# EAGLE design BK-GBC (EAGLE 9.1.0)
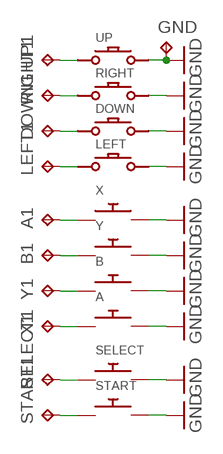
[diagram p0: schematic, sheet 1]

## Parts
A  SWITCH_PUSH_VMUHOLE  [KEYPAD-VMU-HOLE]
A1  TPPAD1-17  [P1-17]
B  SWITCH_PUSH_VMUHOLE  [KEYPAD-VMU-HOLE]
B1  TPPAD1-17  [P1-17]
DOWN  DMG-BTNDPAD  [DS-LITE-DPAD]
DOWN1  TPPAD1-17  [P1-17]
GND  TPPAD1-17  [P1-17]
LEFT  DMG-BTNDPAD  [DS-LITE-DPAD]
LEFT1  TPPAD1-17  [P1-17]
RIGHT  DMG-BTNDPAD  [DS-LITE-DPAD]
RIGHT1  TPPAD1-17  [P1-17]
SELECT  SWITCH_PUSH_VMUSMALL-PAD  [SMALL_KEYPAD]
SELECT1  TPPAD1-17  [P1-17]
START  SWITCH_PUSH_VMUSMALL-PAD  [SMALL_KEYPAD]
START1  TPPAD1-17  [P1-17]
UP  DMG-BTNDPAD  [DS-LITE-DPAD]
UP1  TPPAD1-17  [P1-17]
X  SWITCH_PUSH_VMULARGE-PAD  [KEYPAD_VMU_R26]
X1  TPPAD1-17  [P1-17]
Y  SWITCH_PUSH_VMULARGE-PAD  [KEYPAD_VMU_R26]
Y1  TPPAD1-17  [P1-17]

## Nets
GND: A.2 B.2 DOWN.P$4 GND.TP LEFT.P$4 RIGHT.P$4 SELECT.2 START.2 UP.P$4 X.2 Y.2
N$1: UP1.TP UP.P$3
N$2: RIGHT1.TP RIGHT.P$3
N$3: DOWN1.TP DOWN.P$3
N$4: LEFT1.TP LEFT.P$3
N$5: A1.TP X.1
N$6: B1.TP Y.1
N$7: B.1 Y1.TP
N$8: A.1 X1.TP
N$9: SELECT1.TP SELECT.1
N$10: START1.TP START.1

## Library data of the parts
A B SELECT START X Y = vmuzero:SWITCH_PUSH_VMU: Buttons SWITCH_PUSH_VMU - Soft touch temporary push button for VMU
A1 B1 DOWN1 GND LEFT1 RIGHT1 SELECT1 START1 UP1 X1 Y1 = testpad:TP: Test pad
DOWN LEFT RIGHT UP = Game Boy:DMG-BTN

## Board
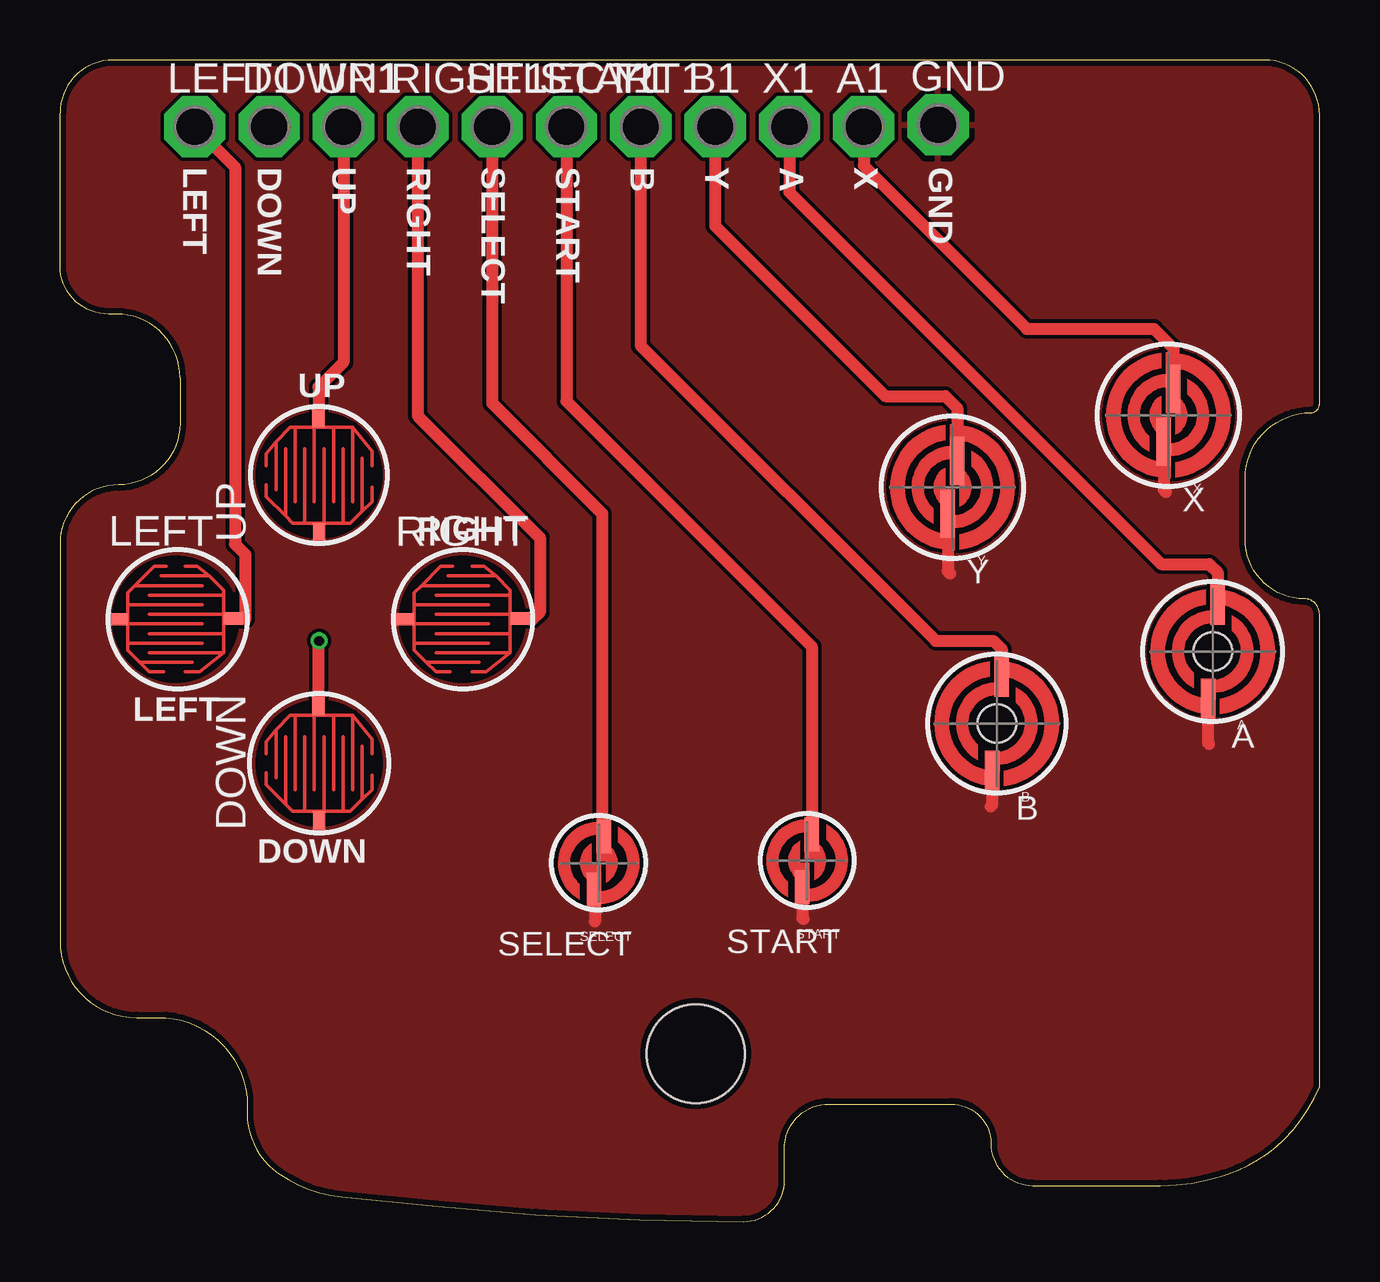
[diagram p1: board, top side]
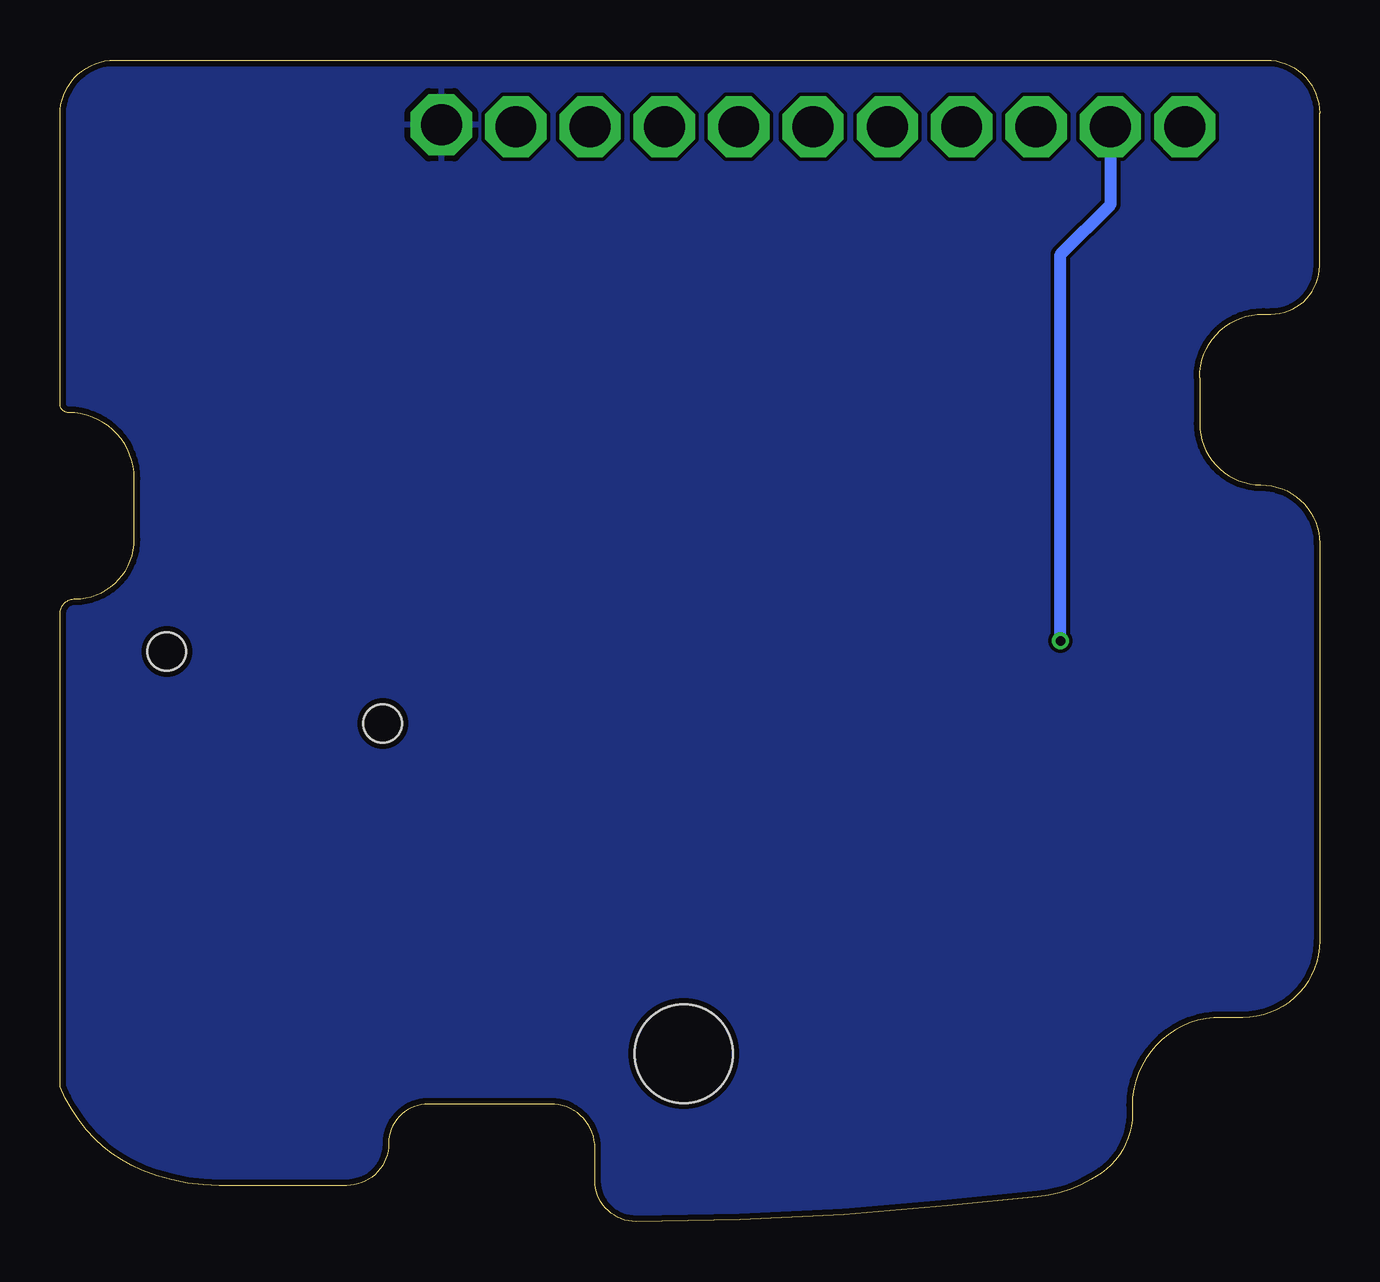
[diagram p2: board, bottom side, seen from below]

Size 52.5 x 48.4 mm. Coordinates in mm from the lower left corner, seen from the top.
Outline: 52.5,5.62 52.5,25.32 arc90 51.87,25.95 arc-90 49.4,28.42 49.4,30.97 arc-90 52.14,33.7 arc90 52.5,34.07 52.5,46.11 arc90 50.21,48.4 2.22,48.4 arc90 0,46.18 0,39.83 arc90 2.03,37.81 2.34,37.81 arc-90 5,35.17 5,33.26 arc-90 2.44,30.7 arc90 0,28.26 0,11.7 arc90 3.2,8.5 4.41,8.5 arc-90 7.8,4.51 arc55 9.1,2.02 arc29 11.75,1.03 15.51,0.65 arc6 28.49,0 arc90 30.2,1.71 30.2,3.05 arc-90 32.05,4.9 37.15,4.9 arc-90 38.8,3.25 arc90 40.55,1.5 45.86,1.5 arc23 49.1,2.15 arc23 51.04,3.44 arc22 52.5,5.62
Copper layers (1*16): Top 0.035mm / dielectric 1.5mm / Bottom 0.035mm
Design rules "SeeedStudio_2layer": minimum track width 6mil, minimum drill 12mil, track to track 6mil, track to pad 6mil, pad to pad 6mil, via to via 6mil, smd to smd 0mil, copper to edge 10mil, drill to drill 10mil, minimum pad ring 10mil, minimum via ring 6mil, stop-mask expansion 2mil, vias tented up to drill 100mil, thermal gap 10mil
Holes 4.1 mm at 26.5,7

### Footprints (pad centres in the part's own frame; a part is rotated, then mirrored left to right if it is on the bottom)
KEYPAD-VMU-HOLE = smd 0.6 x 1.75: 1 -0.2,-2; 2 0.2,2 | hole 1.6: 0,0
P1-17 = drill 1.702 pad 2.54 octagon: TP 0,0
DS-LITE-DPAD = smd 0.813 x 0.508: P$3 2.413,0.025; P$4 -2.413,0
SMALL_KEYPAD = smd 0.6 x 1.4: 1 -0.2,-1.1; 2 0.2,1.1
KEYPAD_VMU_R26 = smd 0.6 x 2: 1 -0.2,-1.1; 2 0.2,1.1

### Placement (x,y rotation side)
A  48.05,23.75 180 top
A1  33.5,45.62 0 top
B  39.05,20.75 180 top
B1  27.31,45.62 0 top
DOWN  10.8,19.1 90 top
DOWN1  8.72,45.62 0 top
GND  36.6,45.7 0 top
LEFT  4.82,25.1 0 top
LEFT1  5.62,45.62 0 top
RIGHT  16.77,25.1 0 top
RIGHT1  14.91,45.62 0 top
SELECT  22.46,14.94 180 top
SELECT1  18.01,45.62 0 top
START  31.14,15.04 180 top
START1  21.11,45.62 0 top
UP  10.8,31.1 90 top
UP1  11.82,45.62 0 top
X  46.2,33.6 180 top
X1  30.4,45.62 0 top
Y  37.2,30.6 180 top
Y1  24.21,45.62 0 top

### Tracks (layer width: path | path; a pad name or v marks a point on that pad's centre or on a via)
GND
  Top 0.508: Y.2 37,27.1 37.1,27 | B.2 38.85,17.35 38.8,17.3 | A.2 47.85,19.95 47.9,19.9 | X.2 46,30.5 46.1,30.4 | START.2 30.94,12.66 31,12.6 | SELECT.2 22.3,13.8 22.3,12.5
  pour Top: -0.6,48.8 -0.6,-0.6 54,-0.6 54,48.8
  pour Bottom: -0.6,48.8 -0.6,-0.6 54,-0.6 54,48.8
N$1
  Top 0.508: UP1.TP 11.82,35.82 10.78,34.77 UP.P$3
N$2
  Top 0.508: RIGHT1.TP 14.91,33.59 20,28.5 20,25.4 19.7,25.1 19.68,25.12 | 19.68,25.12 | 19.68,25.12 RIGHT.P$3
N$3  (via drill 0.4)
  Top 0.508: DOWN.P$3 10.78,24.18 v10.8,24.2
  Bottom 0.508: v10.8,24.2 10.8,40.3 8.7,42.4 8.7,45.6 DOWN1.TP
N$4
  Top 0.508: LEFT1.TP 7.3,43.94 7.3,28.23 7.73,27.8 7.73,25.12 | 7.73,25.12 7.73,25.1 7.73,25.12 | 7.73,25.12 LEFT.P$3
N$5
  Top 0.508: A1.TP 33.5,44 40.3,37.2 45.6,37.2 46.4,36.4 X.1
N$6
  Top 0.508: B1.TP 27.31,41.49 34.4,34.4 36.9,34.4 37.4,33.9 Y.1
N$7
  Top 0.508: Y1.TP 24.21,36.49 36.5,24.2 38.9,24.2 39.25,23.85 B.1
N$8
  Top 0.508: X1.TP 30.4,42.9 45.9,27.4 47.9,27.4 48.25,27.05 A.1
N$9
  Top 0.508: SELECT1.TP 18.01,34.09 22.6,29.5 22.6,16.1 SELECT.1
N$10
  Top 0.508: START1.TP 21.11,34.19 31.34,23.96 START.1

### Text on the board
_tsilk: LEFT | DOWN | UP | RIGHT | SELECT | START | B | Y | A | X | GND | UP | X | RIGHT | Y | LEFT | A | B | DOWN | SELECT | START
122bmp: LEFT | DOWN | UP | RIGHT | SELECT | START | B | Y | A | X | GND | DRILL HERE 1/16